# Altium schematic sheet 23005_2.SchDoc: Classic Computer IO Platform
size A3; Date: 06/11/2018; CompanyName: Heber Ltd; Organization: Heber Limited; DocumentNumber: 56-23005; Revision: 3; SheetNumber: 2; SheetTotal: 6
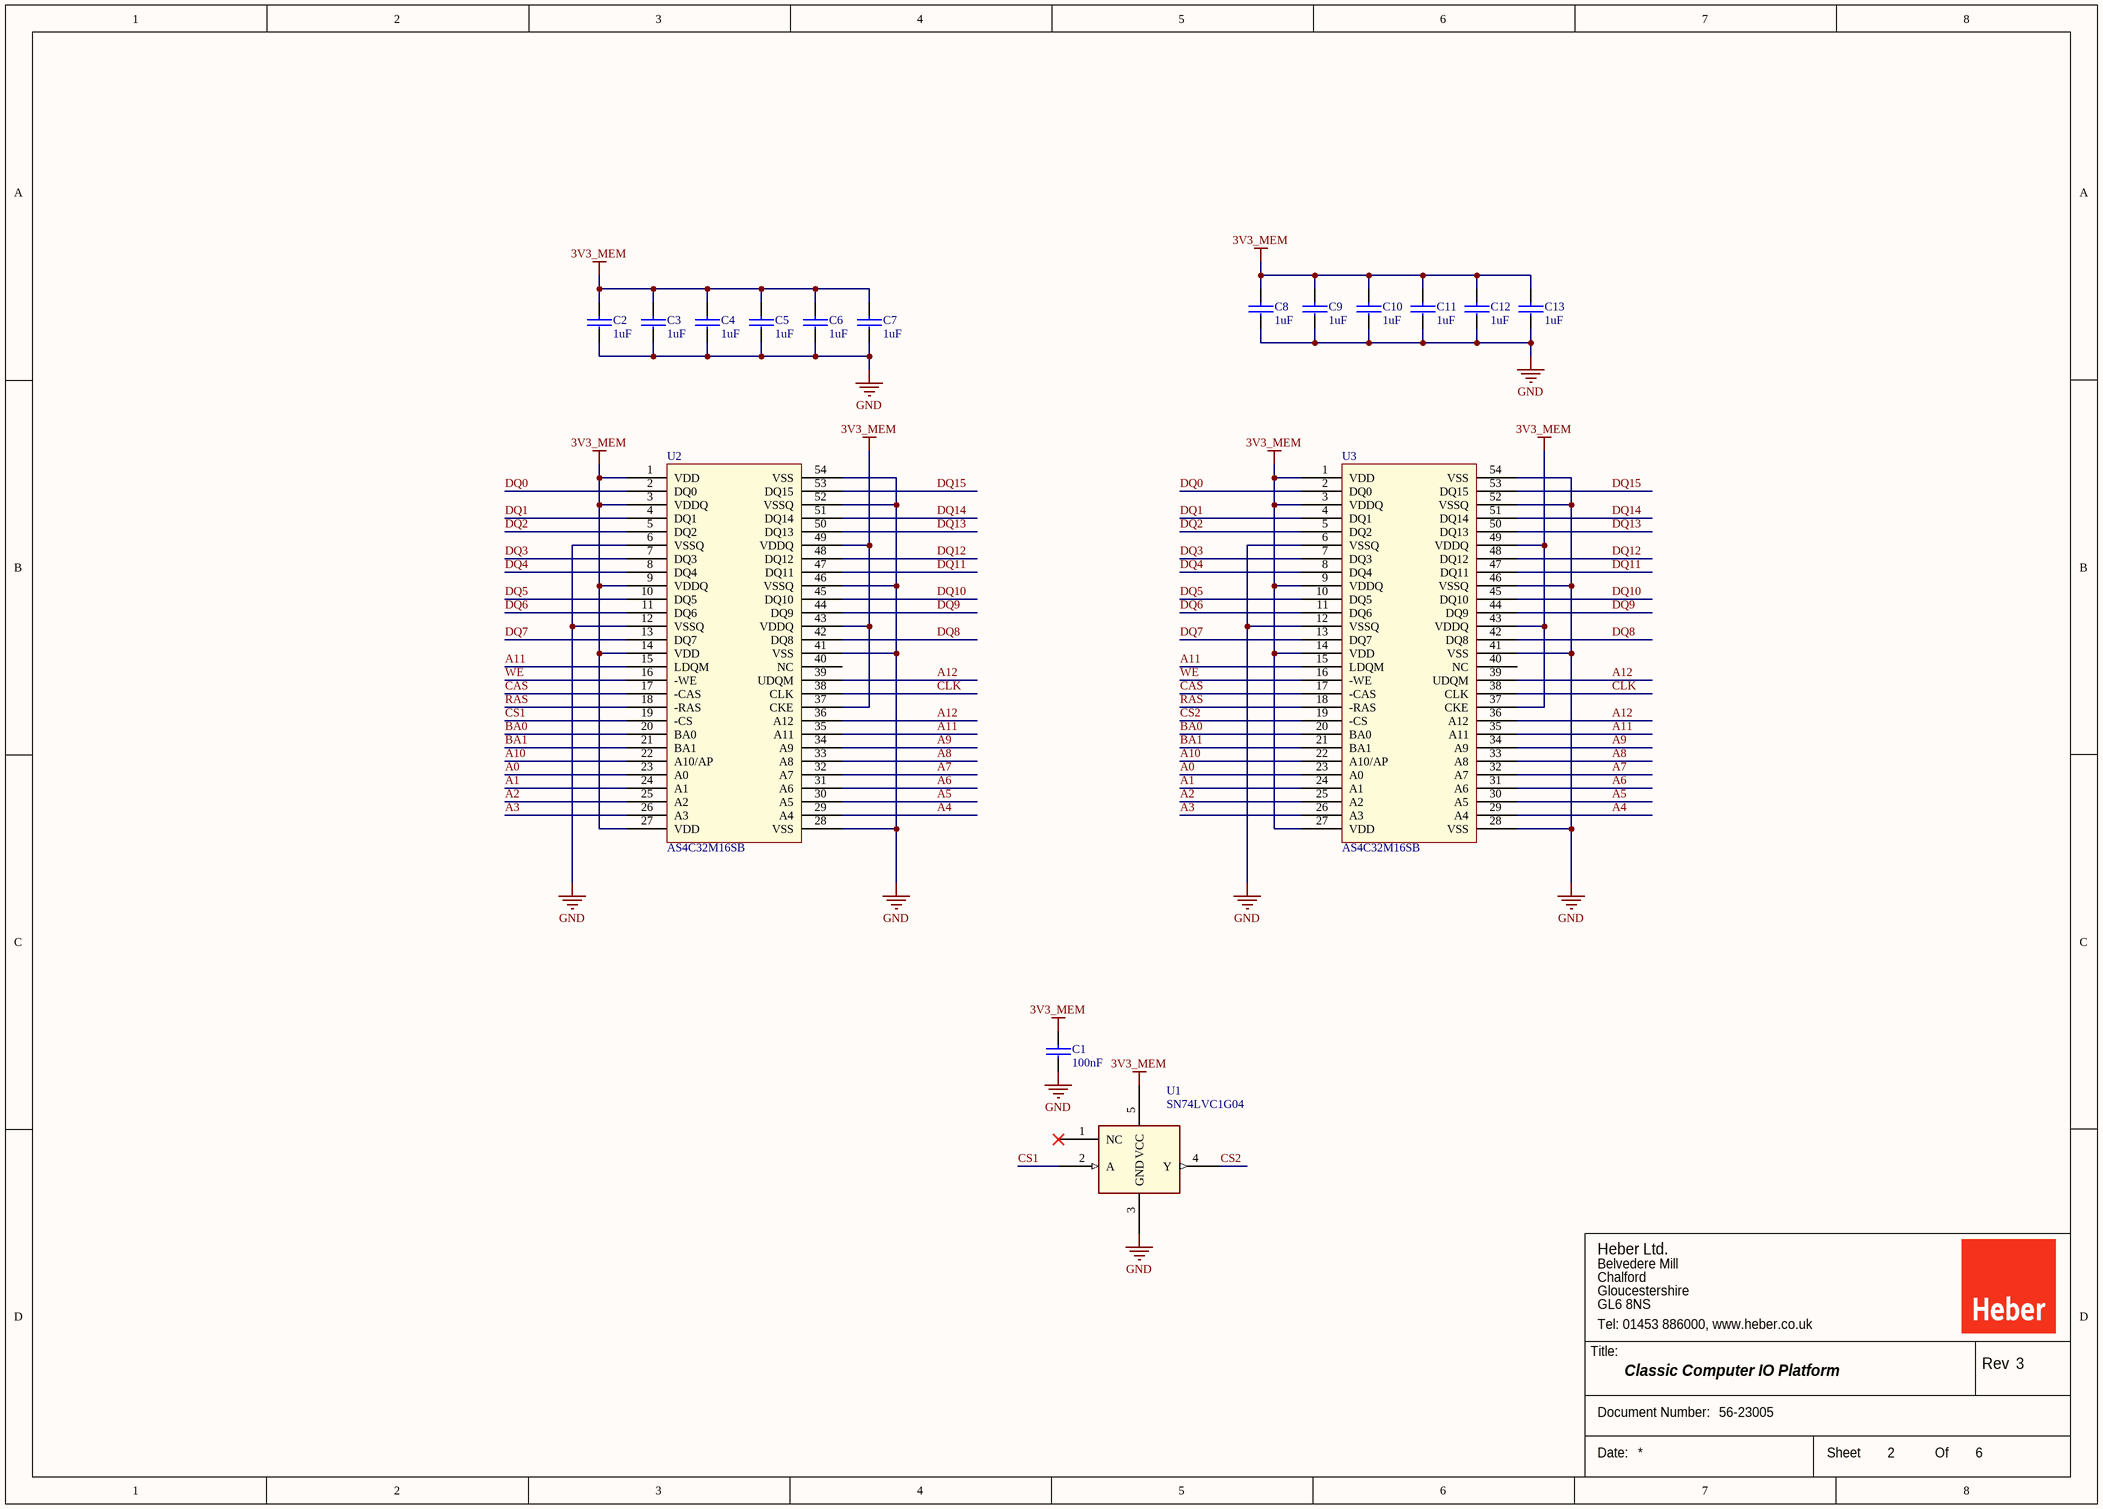
[diagram p0: 23005_2.SchDoc]

## Parts
C1  100nF  [SM0603]
C2  1uF  [SM0603]
C3  1uF  [SM0603]
C4  1uF  [SM0603]
C5  1uF  [SM0603]
C6  1uF  [SM0603]
C7  1uF  [SM0603]
C8  1uF  [SM0603]
C9  1uF  [SM0603]
C10  1uF  [SM0603]
C11  1uF  [SM0603]
C12  1uF  [SM0603]
C13  1uF  [SM0603]
U1  SN74LVC1G04  [SOT23-5]
U2  AS4C32M16SB  [TSOP54/080]
U3  AS4C32M16SB  [TSOP54/080]

## Nets
3V3_MEM: C1.1 C2.1 C3.1 C4.1 C5.1 C6.1 C7.1 C8.1 C9.1 C10.1 C11.1 C12.1 C13.1 U1.5(VCC) U2.1(VDD) U2.3(VDDQ) U2.9(VDDQ) U2.14(VDD) U2.27(VDD) U2.37(CKE) U2.43(VDDQ) U2.49(VDDQ) U3.1(VDD) U3.3(VDDQ) U3.9(VDDQ) U3.14(VDD) U3.27(VDD) U3.37(CKE) U3.43(VDDQ) U3.49(VDDQ)
GND: C1.2 C2.2 C3.2 C4.2 C5.2 C6.2 C7.2 C8.2 C9.2 C10.2 C11.2 C12.2 C13.2 U1.3(GND) U2.6(VSSQ) U2.12(VSSQ) U2.28(VSS) U2.41(VSS) U2.46(VSSQ) U2.52(VSSQ) U2.54(VSS) U3.6(VSSQ) U3.12(VSSQ) U3.28(VSS) U3.41(VSS) U3.46(VSSQ) U3.52(VSSQ) U3.54(VSS)
A0: U2.23(A0) U3.23(A0)
A1: U2.24(A1) U3.24(A1)
A2: U2.25(A2) U3.25(A2)
A3: U2.26(A3) U3.26(A3)
A4: U2.29(A4) U3.29(A4)
A5: U2.30(A5) U3.30(A5)
A6: U2.31(A6) U3.31(A6)
A7: U2.32(A7) U3.32(A7)
A8: U2.33(A8) U3.33(A8)
A9: U2.34(A9) U3.34(A9)
A10: U2.22(A10/AP) U3.22(A10/AP)
A11: U2.15(LDQM) U2.35(A11) U3.15(LDQM) U3.35(A11)
A12: U2.36(A12) U2.39(UDQM) U3.36(A12) U3.39(UDQM)
BA0: U2.20(BA0) U3.20(BA0)
BA1: U2.21(BA1) U3.21(BA1)
CAS: U2.17(-CAS) U3.17(-CAS)
CLK: U2.38(CLK) U3.38(CLK)
CS1: U1.2(A) U2.19(-CS)
CS2: U1.4(Y) U3.19(-CS)
DQ0: U2.2(DQ0) U3.2(DQ0)
DQ1: U2.4(DQ1) U3.4(DQ1)
DQ2: U2.5(DQ2) U3.5(DQ2)
DQ3: U2.7(DQ3) U3.7(DQ3)
DQ4: U2.8(DQ4) U3.8(DQ4)
DQ5: U2.10(DQ5) U3.10(DQ5)
DQ6: U2.11(DQ6) U3.11(DQ6)
DQ7: U2.13(DQ7) U3.13(DQ7)
DQ8: U2.42(DQ8) U3.42(DQ8)
DQ9: U2.44(DQ9) U3.44(DQ9)
DQ10: U2.45(DQ10) U3.45(DQ10)
DQ11: U2.47(DQ11) U3.47(DQ11)
DQ12: U2.48(DQ12) U3.48(DQ12)
DQ13: U2.50(DQ13) U3.50(DQ13)
DQ14: U2.51(DQ14) U3.51(DQ14)
DQ15: U2.53(DQ15) U3.53(DQ15)
RAS: U2.18(-RAS) U3.18(-RAS)
WE: U2.16(-WE) U3.16(-WE)

Not connected (* = marked no-connect by the designer): U1 1(NC)*; U2 40(NC); U3 40(NC)

## Notes on the sheet
- Heber Ltd.
- Belvedere Mill
- Chalford
- GL6 8NS
- Gloucestershire
- Tel: 01453 886000, www.heber.co.uk
- Title:
- Rev
- Document Number:
- Date:
- Sheet
- Of

## Library data of the parts
C1-C13 = C
U1 = SN74LVC1G07